# EAGLE design circuit_breaker_detector (EAGLE 5.10)
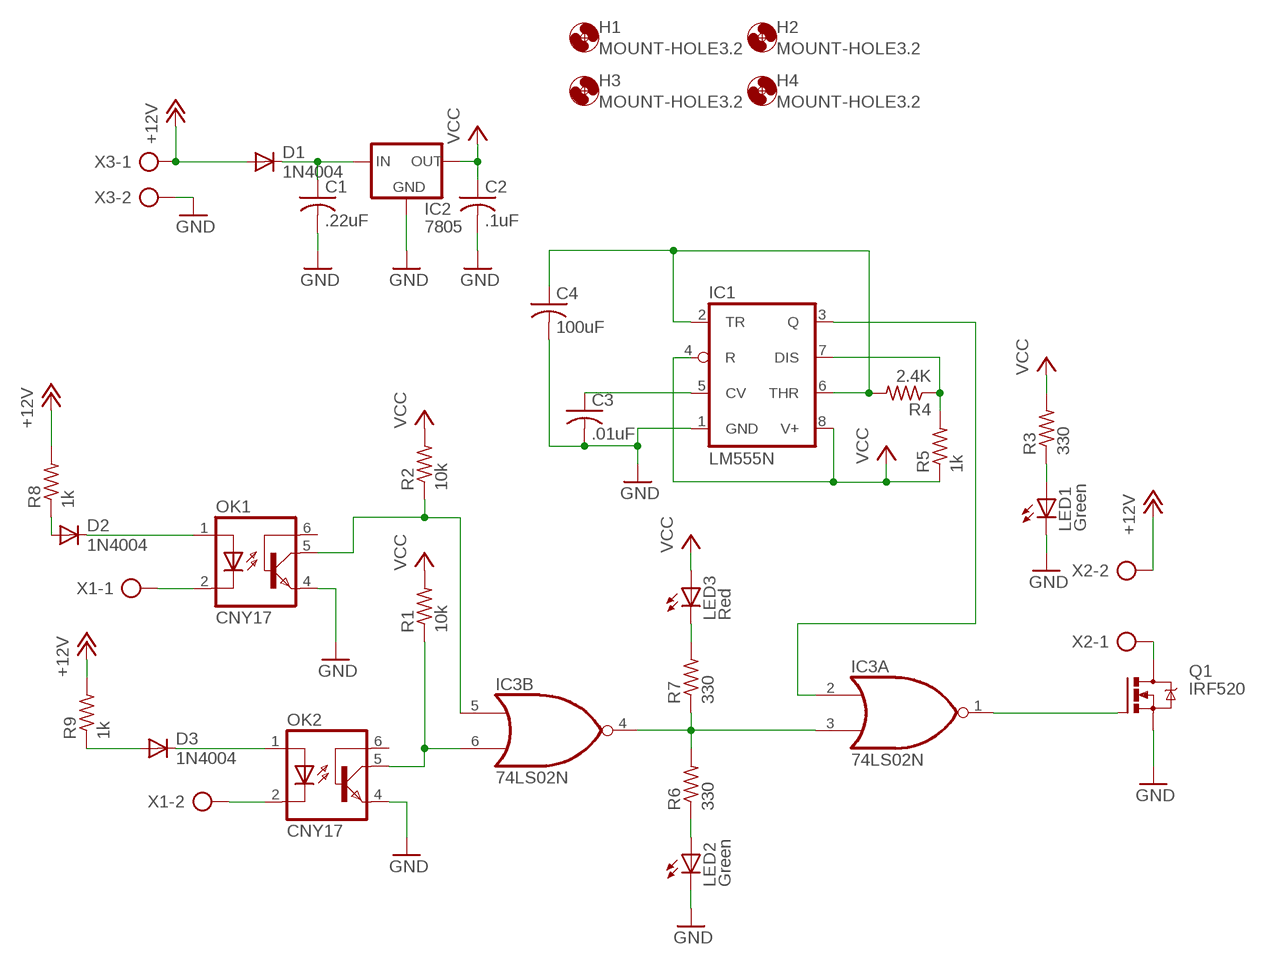
[diagram p0: schematic, sheet 1]

## Parts
C1  .22uF  C-US025-030X050  [C025-030X050]
C2  .1uF  C-US025-030X050  [C025-030X050]
C3  .01uF  C-US025-030X050  [C025-030X050]
C4  100uF  C-US025-030X050  [C025-030X050]
D1  1N4004  [DO41-10]
D2  1N4004  [DO41-10]
D3  1N4004  [DO41-10]
H1  MOUNT-HOLE3.2  [3,2]
H2  MOUNT-HOLE3.2  [3,2]
H3  MOUNT-HOLE3.2  [3,2]
H4  MOUNT-HOLE3.2  [3,2]
IC1  LM555N  [DIL08]
IC2  7805  78XXS  [78XXS]
IC3  74LS02N  [DIL14]
LED1  Green  LED3MM  [LED3MM]
LED2  Green  LED3MM  [LED3MM]
LED3  Red  LED3MM  [LED3MM]
OK1  CNY17  [DIL06]
OK2  CNY17  [DIL06]
Q1  IRF520  [TO220BV]
R1  10k  R-US_0207/10  [0207/10]
R2  10k  R-US_0207/10  [0207/10]
R3  330  R-US_0207/10  [0207/10]
R4  2.4K  R-US_0207/10  [0207/10]
R5  1k  R-US_0207/10  [0207/10]
R6  330  R-US_0207/10  [0207/10]
R7  330  R-US_0207/10  [0207/10]
R8  1k  R-US_0207/10  [0207/10]
R9  1k  R-US_0207/10  [0207/10]
X1  AK300/2  [AK300/2]
X2  AK300/2  [AK300/2]
X3  AK300/2  [AK300/2]

## Nets
+12V: D1.A R8.2 R9.2 X2.2 X3.1
GND: C1.2 C2.2 C3.2 C4.2 IC1.1(GND) IC2.GND LED1.K(C) LED2.K(C) OK1.4(EMI) OK2.4(EMI) Q1.S X3.2
N$1: Q1.D X2.1
N$2: LED1.A R3.1
N$3: C1.1 D1.C IC2.IN
N$4: IC3.5(B:I0) OK1.5(COL) R2.1
N$5: IC3.6(B:I1) OK2.5(COL) R1.1
N$6: C3.1 IC1.5(CV)
N$7: IC3.3(A:I1) IC3.4(B:O) R6.2 R7.1
N$8: C4.1 IC1.2(TR) IC1.6(THR) R4.2
N$9: IC1.7(DIS) R4.1 R5.2
N$10: IC1.3(Q) IC3.2(A:I0)
N$11: IC3.1(A:O) Q1.G
N$12: LED2.A R6.1
N$13: LED3.K(C) R7.2
N$14: OK2.2(C) X1.2
N$15: OK1.2(C) X1.1
N$16: D2.A R8.1
N$17: D2.C OK1.1(A)
N$18: D3.A R9.1
N$19: D3.C OK2.1(A)
VCC: C2.1 IC1.4(R) IC1.8(V+) IC2.OUT LED3.A R1.2 R2.2 R3.2 R5.1
Unconnected: IC3.8(C:I0) IC3.9(C:I1) IC3.10(C:O) IC3.11(D:I0) IC3.12(D:I1) IC3.13(D:O) OK1.6(BAS) OK2.6(BAS)

## Power pins joined to a net without a drawn wire
GND: IC3.7(P:GND)
VCC: IC3.14(P:VCC)

## Library data of the parts
C1-C4 = resistor:C-US: CAPACITOR, American symbol
D1-D3 = diode:1N4004: DIODE general purpose rectifier, 1 A
H1-H4 = holes:MOUNT-HOLE: MOUNTING HOLE with drill center marker
IC1 = linear:*555: TIMER
IC2 = v-reg:78XXS: VOLTAGE REGULATOR
IC3 = 74xx-us:74*02: Quad 2-input NOR gate
LED1-LED3 = led:LED: LED OSRAM: - CHIPLED LG R971, LG N971, LY N971, LG Q971, LY Q971, LO R971, LY R971 LH N974, LH R974 LS Q976, LO Q976, LY Q976 LO Q996 - Hyper CHIPLED LW Q18S LB Q993, LB Q99A, LB R99A - SideLED LS A670, LO A670, LY A670, LG A670, LP A670 LB A673, LV A673, LT A673, LW A673 LH A674 LY A675 LS A676, LA A676, LO A676, LY A676, LW A676 LS A679, LY A679, LG A679 - Hyper Micro SIDELED® LS Y876, LA Y876, LO Y876, LY Y876 LT Y87S - SmartLED LW L88C, LW L88S LB L89C, LB L89S, LG L890 LS L89K, LO L89K, LY L89K LS L896, LA L896, LO L896, LY L896 - TOPLED LS T670, LO T670, LY T670, LG T670, LP T670 LSG T670, LSP T670, LSY T670, LOP T670, LYG T670 LG T671, LOG T671, LSG T671 LB T673, LV T673, LT T673, LW T673 LH T674 LS T676, LA T676, LO T676, LY T676, LB T676, LH T676, LSB T676, LW T676 LB T67C, LV T67C, LT T67C, LS T67K, LO T67K, LY T67K, LW E67C LS E67B, LA E67B, LO E67B, LY E67B, LB E67C, LV E67C, LT E67C LW T67C LS T679, LY T679, LG T679 LS T770, LO T770, LY T770, LG T770, LP T770 LB T773, LV T773, LT T773, LW T773 LH T774 LS E675, LA E675, LY E675, LS T675 LS T776, LA T776, LO T776, LY T776, LB T776 LHGB T686 LT T68C, LB T68C - Hyper Mini TOPLED® LB M676 - Mini TOPLED Santana® LG M470 LS M47K, LO M47K, LY M47K Source: http://www.osram.convergy.de LUXEON: - LUMILED® LXK2-PW12-R00, LXK2-PW12-S00, LXK2-PW14-U00, LXK2-PW14-V00 LXK2-PM12-R00, LXK2-PM12-S00, LXK2-PM14-U00 LXK2-PE12-Q00, LXK2-PE12-R00, LXK2-PE12-S00, LXK2-PE14-T00, LXK2-PE14-U00 LXK2-PB12-K00, LXK2-PB12-L00, LXK2-PB12-M00, LXK2-PB14-N00, LXK2-PB14-P00, LXK2-PB14-Q00 LXK2-PR12-L00, LXK2-PR12-M00, LXK2-PR14-Q00, LXK2-PR14-R00 LXK2-PD12-Q00, LXK2-PD12-R00, LXK2-PD12-S00 LXK2-PH12-R00, LXK2-PH12-S00 LXK2-PL12-P00, LXK2-PL12-Q00, LXK2-PL12-R00 Source: www.luxeon.com KINGBRIGHT: KA-3528ASYC Source: www.kingbright.com
OK1 OK2 = optocoupler:CNY17: SIEMENS OPTO COUPLER
Q1 = transistor-power:IRF520: HEXFET Power MOSFET
R1-R9 = resistor:R-US_: RESISTOR, American symbol
X1-X3 = con-ptr500:AK300/2: CONNECTOR

## Board
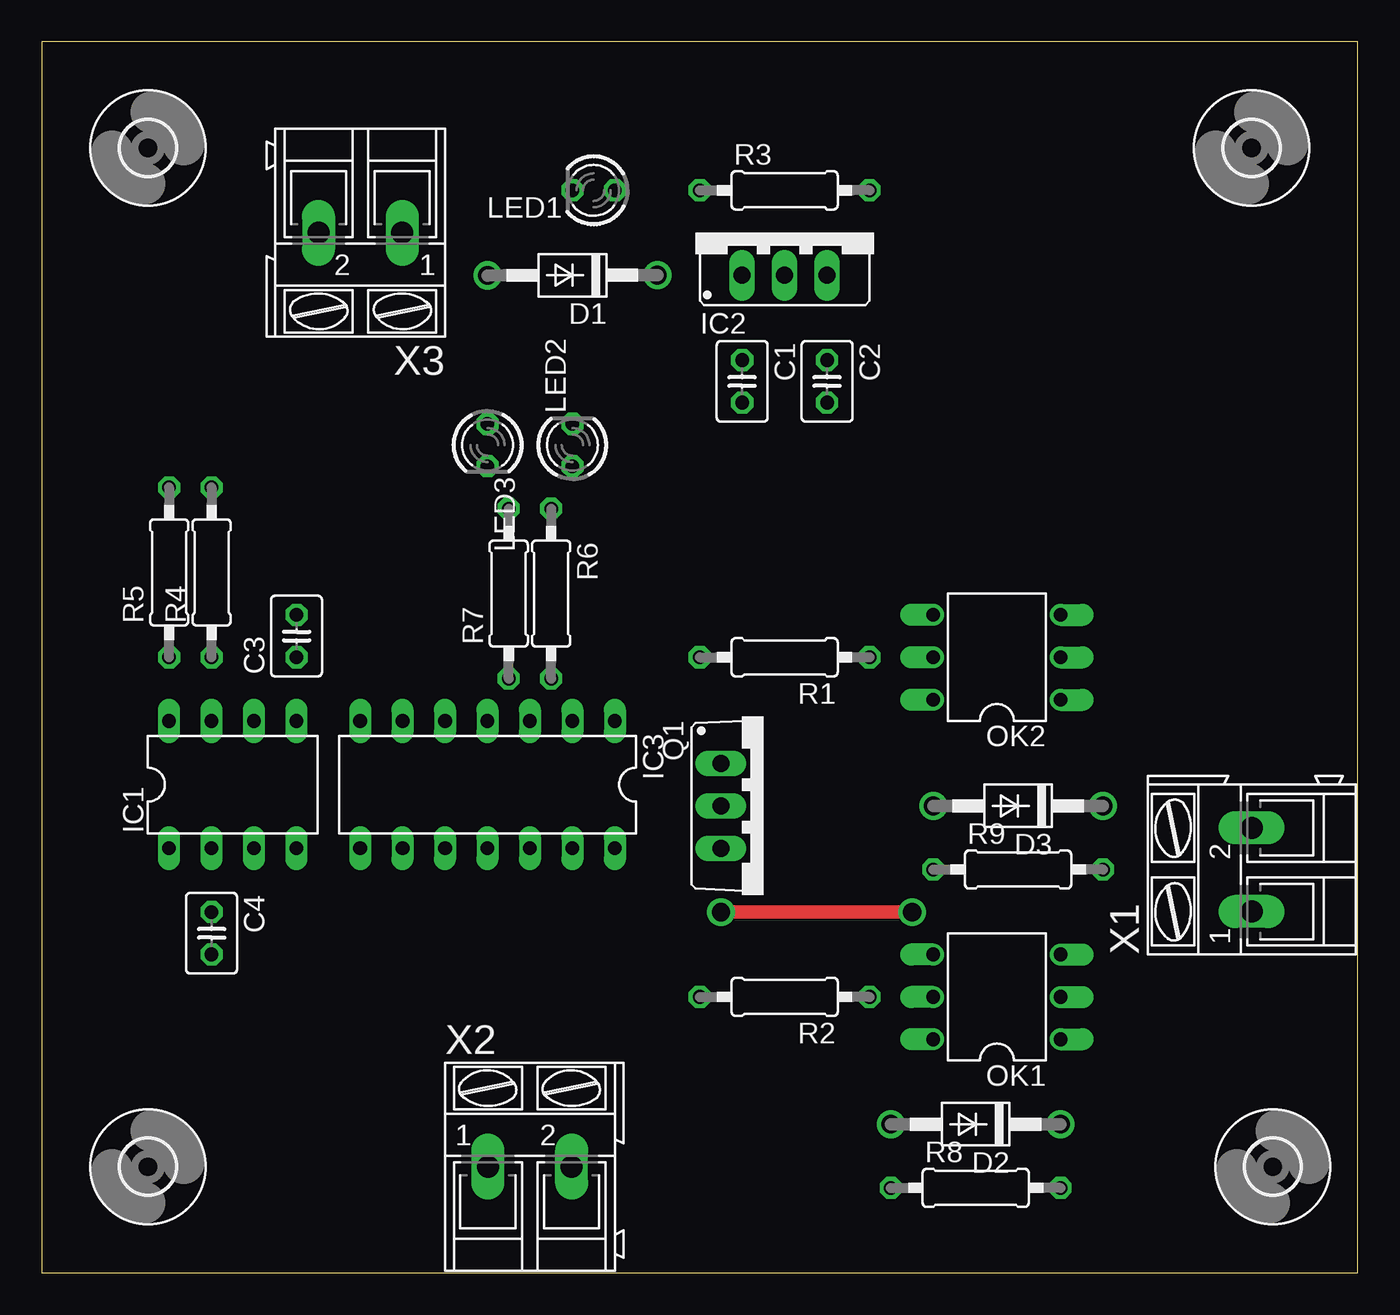
[diagram p1: board, top side]
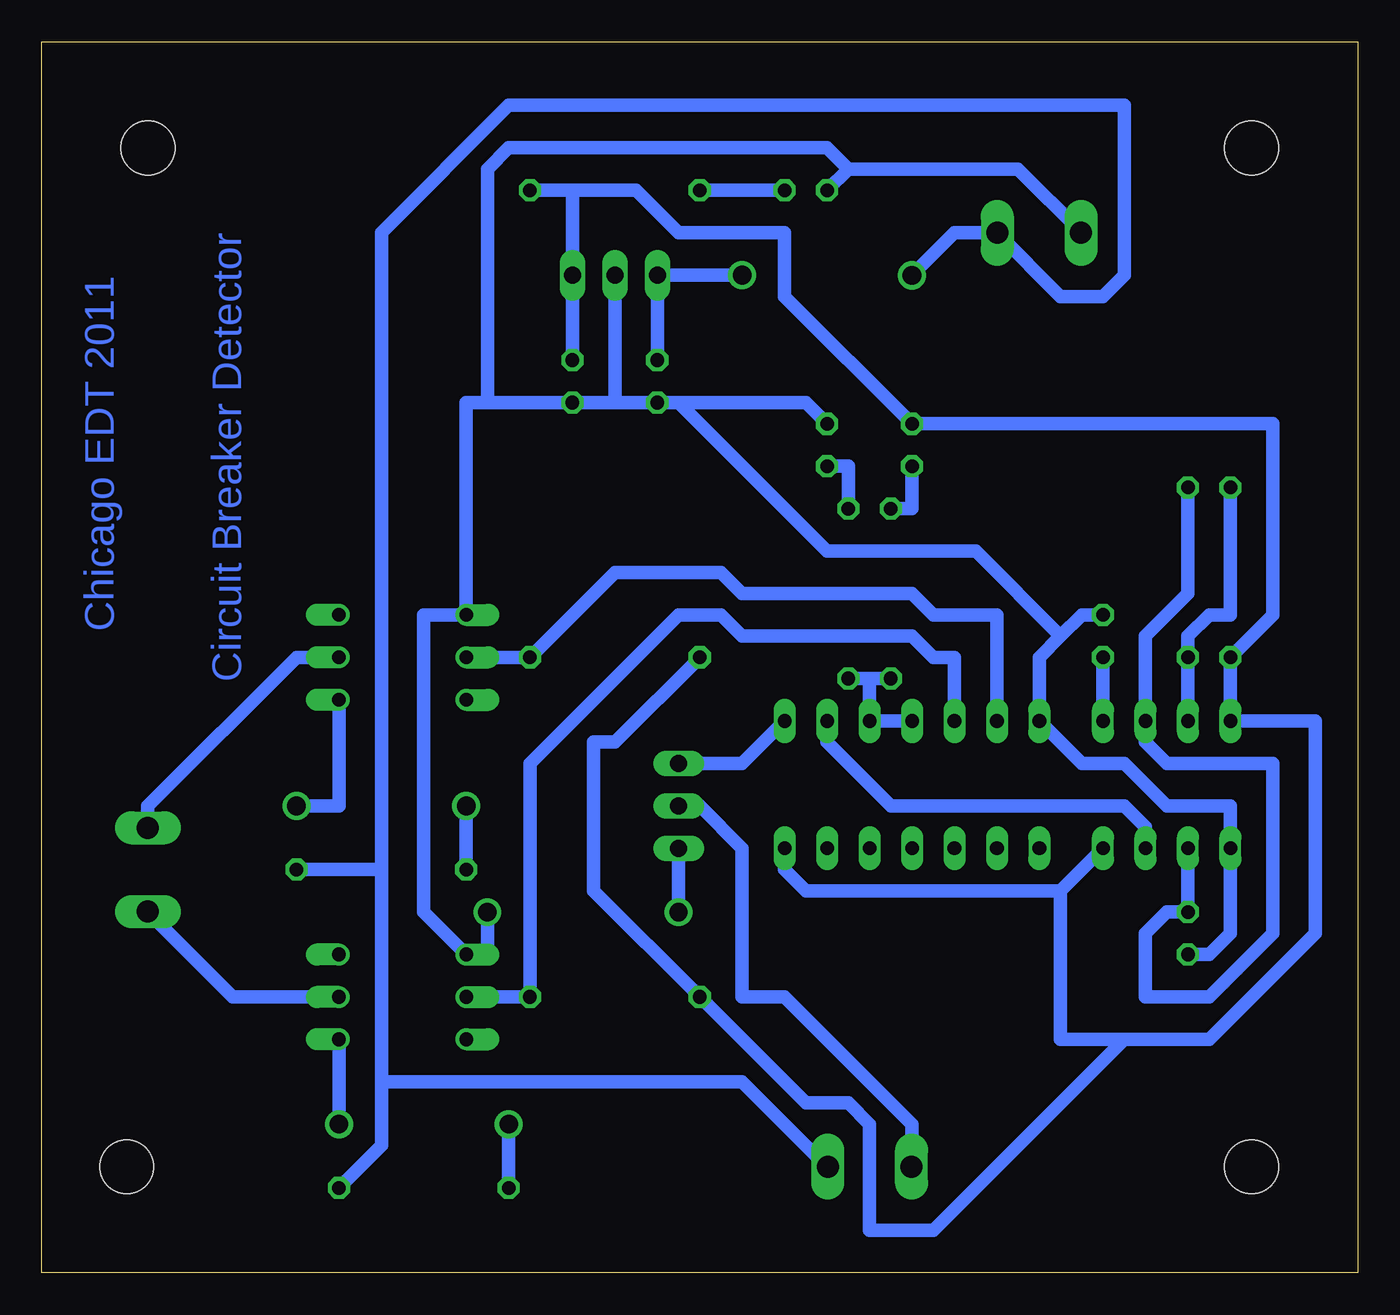
[diagram p2: board, bottom side, seen from below]

Size 78.74 x 73.66 mm. Coordinates in mm from the lower left corner, seen from the top.
Outline: 0,0 78.74,0 78.74,73.66 0,73.66 0,0
Copper layers (1*16): Top 0.035mm / dielectric 1.5mm / Bottom 0.035mm
Design rules "default *": minimum track width 32mil, minimum drill 24mil, track to track 30mil, track to pad 30mil, pad to pad 30mil, via to via 16mil, smd to smd 8mil, copper to edge 40mil, drill to drill 16mil, minimum pad ring 10mil, minimum via ring 8mil, stop-mask expansion 4mil, vias tented up to drill 0mil, thermal gap 10mil

### Footprints (pad centres in the part's own frame; a part is rotated, then mirrored left to right if it is on the bottom)
C025-030X050 = drill 0.813 octagon: 1 -1.27,0; 2 1.27,0
DO41-10 = drill 1.118 round: A 5.08,0; C -5.08,0
3,2 = hole 3.2: 0,0
DIL08 = drill 0.813 long: 1 -3.81,-3.81; 2 -1.27,-3.81; 3 1.27,-3.81; 4 3.81,-3.81; 5 3.81,3.81; 6 1.27,3.81; 7 -1.27,3.81; 8 -3.81,3.81
78XXS = drill 1.016 long: GND 0,-2.54; IN -2.54,-2.54; OUT 2.54,-2.54
DIL14 = drill 0.813 long: 1 -7.62,-3.81; 2 -5.08,-3.81; 3 -2.54,-3.81; 4 0,-3.81; 5 2.54,-3.81; 6 5.08,-3.81; 7 7.62,-3.81; 8 7.62,3.81; 9 5.08,3.81; 10 2.54,3.81; 11 0,3.81; 12 -2.54,3.81; 13 -5.08,3.81; 14 -7.62,3.81
LED3MM = drill 0.813 octagon: A -1.27,0; K 1.27,0
DIL06 = drill 0.813 offset: 1 -2.54,-3.81; 2 0,-3.81; 3 2.54,-3.81; 4 2.54,3.81; 5 0,3.81; 6 -2.54,3.81
TO220BV = drill 1.016 long: D 0,-2.54; G -2.54,-2.54; S 2.54,-2.54
0207/10 = drill 0.813 octagon: 1 -5.08,0; 2 5.08,0
AK300/2 = drill 1.321 long: 1 -2.515,0; 2 2.489,0

### Placement (x,y rotation side)
C1  41.91,53.34 270 top
C2  46.99,53.34 270 top
C3  15.24,38.1 90 top
C4  10.16,20.32 270 top
D1  31.75,59.69 180.1 top
D2  55.88,8.89 180 top
D3  58.42,27.94 180 top
H1  6.35,6.35 0 top
H2  6.35,67.31 0 top
H3  72.39,67.31 0 top
H4  73.66,6.35 0 top
IC1  11.43,29.21 0 top
IC2  44.45,62.23 0 top
IC3  26.67,29.21 180 top
LED1  33.02,64.77 180 top
LED2  31.75,49.53 90 top
LED3  26.67,49.53 270 top
OK1  57.15,16.51 90 top
OK2  57.15,36.83 90 top
Q1  43.18,27.94 270 top
R1  44.45,36.83 180 top
R2  44.45,16.51 180 top
R3  44.45,64.77 0 top
R4  10.16,41.91 90 top
R5  7.62,41.91 90 top
R6  30.48,40.64 270 top
R7  27.94,40.64 90 top
R8  55.88,5.08 0 top
R9  58.42,24.13 0 top
X1  72.39,24.13 90 top
X2  29.21,6.35 0 top
X3  19.05,62.23 180 top

### Tracks (layer width: path | path; a pad name or v marks a point on that pad's centre or on a via)
+12V
  Bottom 0.813: 21.59,62.23 24.13,62.23 D1.A | R8.2 58.42,7.62 58.42,11.43 | 58.42,11.43 58.42,24.13 | 58.42,24.13 R9.2 | 58.42,11.43 36.83,11.43 31.75,6.35 X2.2 | 21.59,62.23 17.78,58.42 15.24,58.42 13.97,59.69 13.97,69.85 50.8,69.85 58.42,62.23 58.42,24.13 | 21.59,62.23 X3.1
GND  (via drill 1.1)
  Top 0.813: v52.07,21.59 v40.64,21.59
  Bottom 0.813: C4.2 8.89,19.05 7.62,20.32 IC1.1 7.62,27.94 11.43,27.94 13.97,30.48 16.51,30.48 IC3.7 19.05,36.83 17.78,38.1 | C3.2 16.51,39.37 17.78,38.1 | 30.48,66.04 LED1.K | 30.48,66.04 20.32,66.04 16.51,62.23 X3.2 | LED2.K 33.02,52.07 40.64,52.07 | 40.64,52.07 C1.2 44.45,52.07 | 44.45,52.07 C2.2 52.07,52.07 | 44.45,52.07 IC2.GND | 30.48,66.04 31.75,67.31 50.8,67.31 52.07,66.04 52.07,52.07 | 52.07,52.07 53.34,52.07 OK2.4 55.88,39.37 55.88,21.59 OK1.4 52.07,19.05 v52.07,21.59 | 17.78,38.1 22.86,43.18 31.75,43.18 40.64,52.07 | v40.64,21.59 Q1.S
N$1
  Bottom 0.813: Q1.D 39.37,27.94 36.83,25.4 36.83,16.51 34.29,16.51 26.67,8.89 26.67,6.35 X2.1
N$2
  Bottom 0.813: LED1.A R3.1
N$3
  Bottom 0.813: C1.1 IC2.IN D1.C
N$4
  Bottom 0.813: OK1.5 R2.1 49.53,30.48 40.64,39.37 38.1,39.37 36.83,38.1 26.67,38.1 25.4,36.83 24.13,36.83 IC3.5
N$5
  Bottom 0.813: IC3.6 21.59,39.37 25.4,39.37 26.67,40.64 36.83,40.64 38.1,41.91 44.45,41.91 R1.1 OK2.5
N$6
  Bottom 0.813: IC1.5 C3.1
N$7
  Bottom 0.813: IC3.4 IC3.3 29.21,35.56 | 29.21,35.56 R6.2 | 29.21,35.56 R7.1
N$8
  Bottom 0.813: IC1.2 C4.1 11.43,21.59 12.7,20.32 12.7,16.51 8.89,16.51 5.08,20.32 5.08,30.48 11.43,30.48 12.7,31.75 IC1.6 12.7,38.1 10.16,40.64 R4.2
N$9
  Bottom 0.813: IC1.7 R4.1 10.16,38.1 8.89,39.37 7.62,39.37 R5.2
N$10
  Bottom 0.813: IC1.3 12.7,26.67 13.97,27.94 27.94,27.94 31.75,31.75 IC3.2
N$11
  Bottom 0.813: IC3.1 36.83,30.48 Q1.G
N$12
  Bottom 0.813: R6.1 30.48,48.26 LED2.A
N$13
  Bottom 0.813: LED3.K 26.67,45.72 R7.2
N$14
  Bottom 0.813: OK2.2 63.5,36.83 72.39,27.94 X1.2
N$15
  Bottom 0.813: OK1.2 67.31,16.51 72.39,21.59 X1.1
N$16
  Bottom 0.813: R8.1 D2.A
N$17
  Bottom 0.813: D2.C OK1.1
N$18
  Bottom 0.813: R9.1 D3.A
N$19
  Bottom 0.813: OK2.1 60.96,27.94 D3.C
VCC
  Bottom 0.813: R1.2 44.45,31.75 45.72,31.75 45.72,22.86 R2.2 33.02,10.16 30.48,10.16 29.21,8.89 29.21,2.54 25.4,2.54 13.97,13.97 | 17.78,22.86 IC1.4 | 17.78,22.86 33.02,22.86 34.29,24.13 IC3.14 | C2.1 IC2.OUT 46.99,64.77 | 46.99,64.77 R3.2 | 46.99,64.77 43.18,64.77 40.64,62.23 34.29,62.23 34.29,58.42 LED3.A 5.08,50.8 5.08,39.37 R5.1 IC1.8 2.54,33.02 2.54,20.32 8.89,13.97 13.97,13.97 | 17.78,22.86 17.78,13.97 13.97,13.97

### Text on the board
Bottom: Circuit Breaker Detector | Chicago EDT 2011